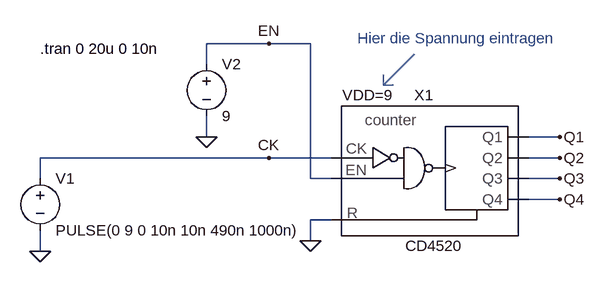
[diagram p0: schematic CD4520_test.asc]
CD4520_test.asc, the LTspice schematic file:
Version 4
SHEET 1 880 680
WIRE -48 -64 -144 -64
WIRE 16 -64 -48 -64
WIRE -144 -32 -144 -64
WIRE -144 80 -144 48
WIRE 400 80 352 80
WIRE -48 112 -400 112
WIRE 48 112 -48 112
WIRE 400 112 352 112
WIRE -400 144 -400 112
WIRE 16 144 16 -64
WIRE 48 144 16 144
WIRE 400 144 352 144
WIRE 400 176 352 176
WIRE 48 208 16 208
WIRE 16 240 16 208
WIRE -400 256 -400 224
FLAG -400 256 0
FLAG -144 80 0
FLAG 16 240 0
FLAG 400 80 Q1
FLAG 400 112 Q2
FLAG 400 144 Q3
FLAG 400 176 Q4
FLAG -48 -64 EN
FLAG -48 112 CK
SYMBOL voltage -400 128 R0
WINDOW 123 0 0 Left 0
WINDOW 39 0 0 Left 0
SYMATTR InstName V1
SYMATTR Value PULSE(0 9 0 10n 10n 490n 1000n)
SYMBOL voltage -144 -48 R0
WINDOW 123 0 0 Left 0
WINDOW 39 0 0 Left 0
SYMATTR InstName V2
SYMATTR Value 9
SYMBOL CD4520 272 -96 R0
SYMATTR InstName X1
SYMATTR SpiceLine VDD=9
TEXT -400 -56 Left 0 !.tran 0 20u 0 10n
TEXT 88 -72 Left 0 ;Hier die Spannung eintragen
LINE Normal 176 -48 128 0
LINE Normal 128 0 144 0
LINE Normal 128 -16 128 0

The netlist it stands for:
* CD4520_test.asc
V1 CK 0 PULSE(0 9 0 10n 10n 490n 1000n)
V2 EN 0 9
XX1 CK EN 0 Q1 Q2 Q3 Q4 CD4520 params: CD4520 VDD=9  ; pins CK EN R Q1 Q2 Q3 Q4
.tran 0 20u 0 10n
* Hier die Spannung eintragen
.backanno
.end